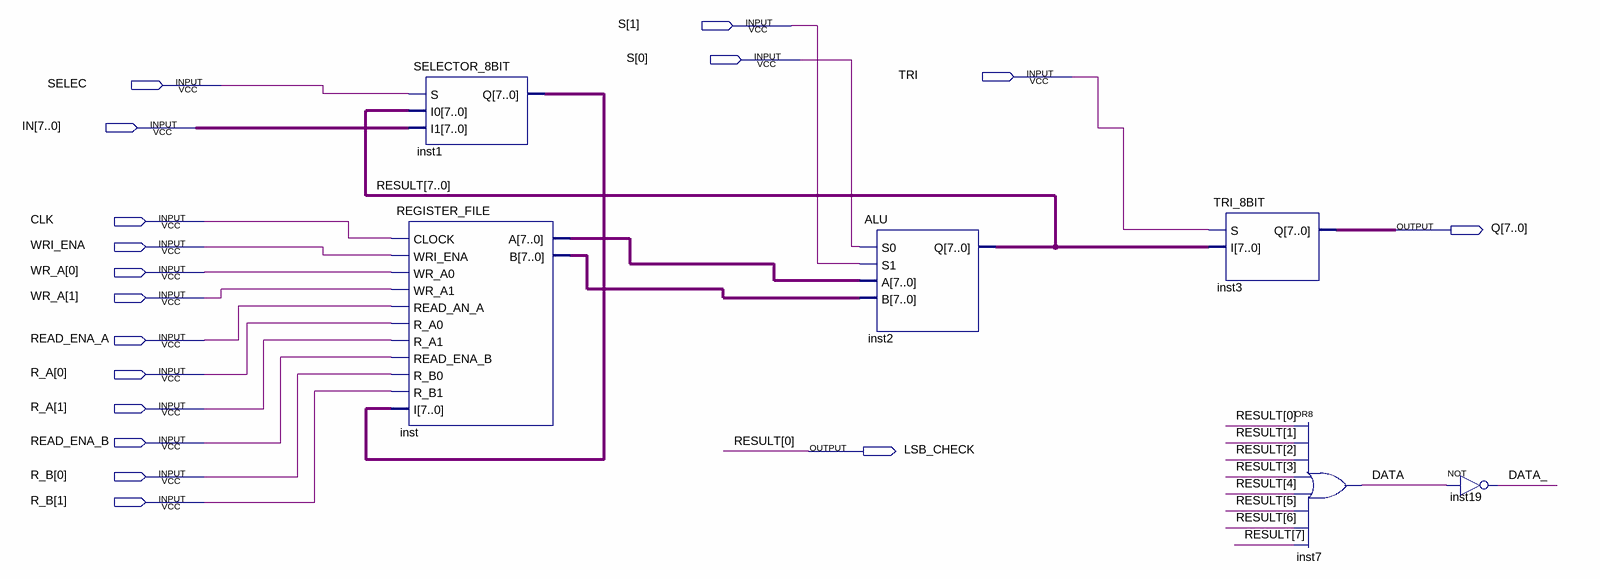
[diagram p0: schematic sheet]
// Quartus schematic TEST.bdf as structural Verilog: 6 symbols, 17 pins
module TEST (
  input  [1:0] S,
  input  TRI,
  input  SELEC,
  input  [7:0] IN,
  input  CLK,
  input  WRI_ENA,
  input  [1:0] WR_A,
  input  READ_ENA_A,
  input  [1:0] R_A,
  input  READ_ENA_B,
  input  [1:0] R_B,
  output [7:0] Q,
  output LSB_CHECK
);

  wire DATA, DATA_;
  wire [7:0] inst1_q, inst_a, inst_b;
  wire [7:1] RESULT;

  REGISTER_FILE inst (
    .CLOCK(CLK), .WRI_ENA(WRI_ENA), .WR_A0(WR_A[0]), .WR_A1(WR_A[1]), .READ_AN_A(READ_ENA_A), .R_A0(R_A[0]),
    .R_A1(R_A[1]), .READ_ENA_B(READ_ENA_B), .R_B0(R_B[0]), .R_B1(R_B[1]), .I(inst1_q), .A(inst_a), .B(inst_b));
  SELECTOR_8BIT inst1 (.S(SELEC), .I0({RESULT, LSB_CHECK}), .I1(IN), .Q(inst1_q));
  ALU inst2 (.S0(S[0]), .S1(S[1]), .A(inst_a), .B(inst_b), .Q({RESULT, LSB_CHECK}));
  TRI_8BIT inst3 (.S(TRI), .I({RESULT, LSB_CHECK}), .Q(Q));
  or inst7 (DATA, LSB_CHECK, RESULT[1], RESULT[2], RESULT[3], RESULT[4], RESULT[5], RESULT[6], RESULT[7]);
  not inst19 (DATA_, DATA);

  // Other names for the same wires on the sheet: RESULT[0] = LSB_CHECK
endmodule
